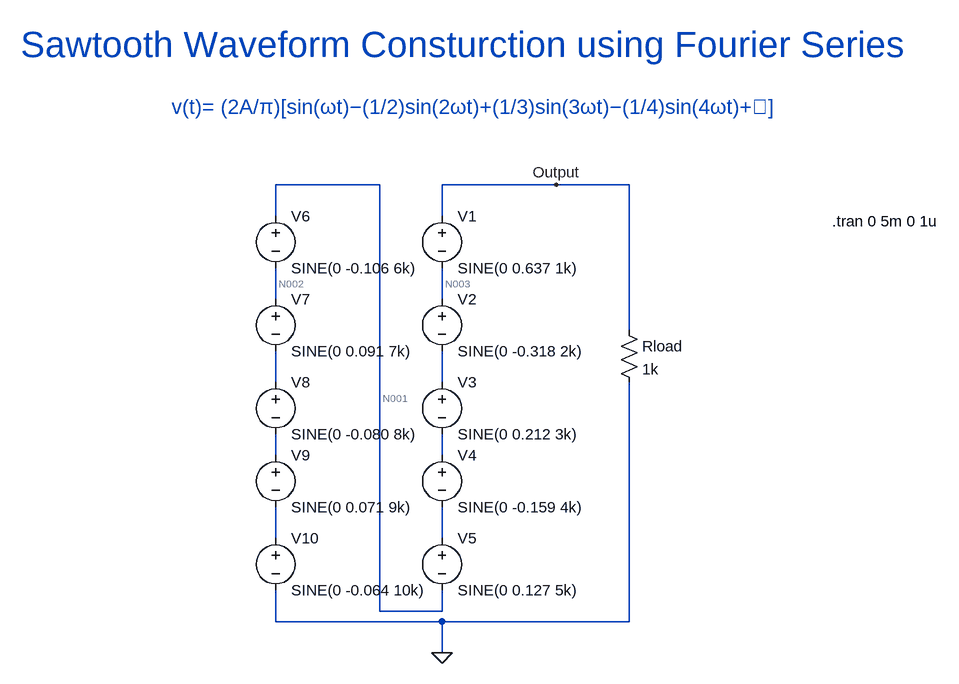
[diagram p0: schematic Sawtooth_wave_gen_fourier_series.asc]
Sawtooth_wave_gen_fourier_series.asc, the LTspice schematic file:
Version 4
SHEET 1 1448 1044
WIRE 528 304 368 304
WIRE 800 304 624 304
WIRE 912 304 800 304
WIRE 368 352 368 304
WIRE 624 352 624 304
WIRE 368 480 368 432
WIRE 624 480 624 432
WIRE 912 528 912 304
WIRE 368 608 368 560
WIRE 624 608 624 560
WIRE 368 720 368 688
WIRE 624 720 624 688
WIRE 368 848 368 800
WIRE 624 848 624 800
WIRE 528 960 528 304
WIRE 624 960 624 928
WIRE 624 960 528 960
WIRE 368 976 368 928
WIRE 624 976 368 976
WIRE 912 976 912 608
WIRE 912 976 624 976
WIRE 624 1024 624 976
FLAG 624 1024 0
FLAG 800 304 Output
SYMBOL voltage 624 336 R0
WINDOW 123 0 0 Left 0
WINDOW 39 0 0 Left 0
SYMATTR InstName V1
SYMATTR Value SINE(0 0.637 1k)
SYMBOL voltage 624 464 R0
WINDOW 123 0 0 Left 0
WINDOW 39 0 0 Left 0
SYMATTR InstName V2
SYMATTR Value SINE(0 -0.318 2k)
SYMBOL voltage 624 592 R0
WINDOW 123 0 0 Left 0
WINDOW 39 0 0 Left 0
SYMATTR InstName V3
SYMATTR Value SINE(0 0.212 3k)
SYMBOL voltage 624 704 R0
WINDOW 123 0 0 Left 0
WINDOW 39 0 0 Left 0
SYMATTR InstName V4
SYMATTR Value SINE(0 -0.159 4k)
SYMBOL voltage 624 832 R0
WINDOW 123 0 0 Left 0
WINDOW 39 0 0 Left 0
SYMATTR InstName V5
SYMATTR Value SINE(0 0.127 5k)
SYMBOL voltage 368 336 R0
WINDOW 123 0 0 Left 0
WINDOW 39 0 0 Left 0
SYMATTR InstName V6
SYMATTR Value SINE(0 -0.106 6k)
SYMBOL voltage 368 464 R0
WINDOW 123 0 0 Left 0
WINDOW 39 0 0 Left 0
SYMATTR InstName V7
SYMATTR Value SINE(0 0.091 7k)
SYMBOL voltage 368 592 R0
WINDOW 123 0 0 Left 0
WINDOW 39 0 0 Left 0
SYMATTR InstName V8
SYMATTR Value SINE(0 -0.080 8k)
SYMBOL voltage 368 704 R0
WINDOW 123 0 0 Left 0
WINDOW 39 0 0 Left 0
SYMATTR InstName V9
SYMATTR Value SINE(0 0.071 9k)
SYMBOL voltage 368 832 R0
WINDOW 123 0 0 Left 0
WINDOW 39 0 0 Left 0
SYMATTR InstName V10
SYMATTR Value SINE(0 -0.064 10k)
SYMBOL res 896 512 R0
SYMATTR InstName Rload
SYMATTR Value 1k
TEXT -24 88 Left 5 ;Sawtooth Waveform Consturction using Fourier Series
TEXT 208 184 Left 3 ;v(t)= (2A/π)​[sin(ωt)−(1/2)sin(2ωt)+(1/3)​sin(3ωt)−(1/4)​sin(4ωt)+⋯]
TEXT 1224 360 Left 2 !.tran 0 5m 0 1u

The netlist it stands for:
* Sawtooth_wave_gen_fourier_series.asc
V1 Output N003 SINE(0 0.637 1k)
V2 N003 N005 SINE(0 -0.318 2k)
V3 N005 N007 SINE(0 0.212 3k)
V4 N007 N009 SINE(0 -0.159 4k)
V5 N009 N001 SINE(0 0.127 5k)
V6 N001 N002 SINE(0 -0.106 6k)
V7 N002 N004 SINE(0 0.091 7k)
V8 N004 N006 SINE(0 -0.080 8k)
V9 N006 N008 SINE(0 0.071 9k)
V10 N008 0 SINE(0 -0.064 10k)
Rload Output 0 1k
* Sawtooth Waveform Consturction using Fourier Series
* v(t)= (2A/π)​[sin(ωt)−(1/2)sin(2ωt)+(1/3)​sin(3ωt)−(1/4)​sin(4ωt)+⋯]
.tran 0 5m 0 1u
.backanno
.end

* Results of the author's LTspice run, read from the files saved beside the schematic
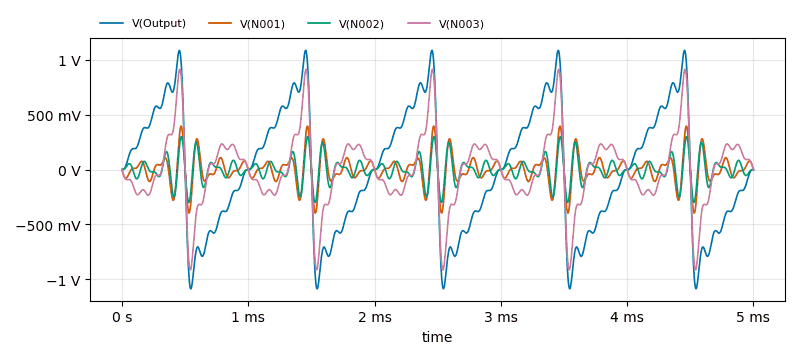
[diagram p1: Transient Analysis of Sawtooth_wave_gen_fourier_series.asc, plotted from the saved traces]
* Transient Analysis, 1 run:
*   V(Output): min -1.087 V, max 1.086 V, average -138.2 nV, rms 560.5 mV, last 0 V
*   V(N001): min -395.9 mV, max 395.8 mV, average 0 V, rms 132.4 mV, last 0 V
*   V(N002): min -299.4 mV, max 299.2 mV, average 193 nV, rms 109.1 mV, last 0 V
*   V(N003): min -914.6 mV, max 914.2 mV, average -129.6 nV, rms 333.6 mV, last 0 V